# EAGLE design neopixel_board (EAGLE 9.2.2)
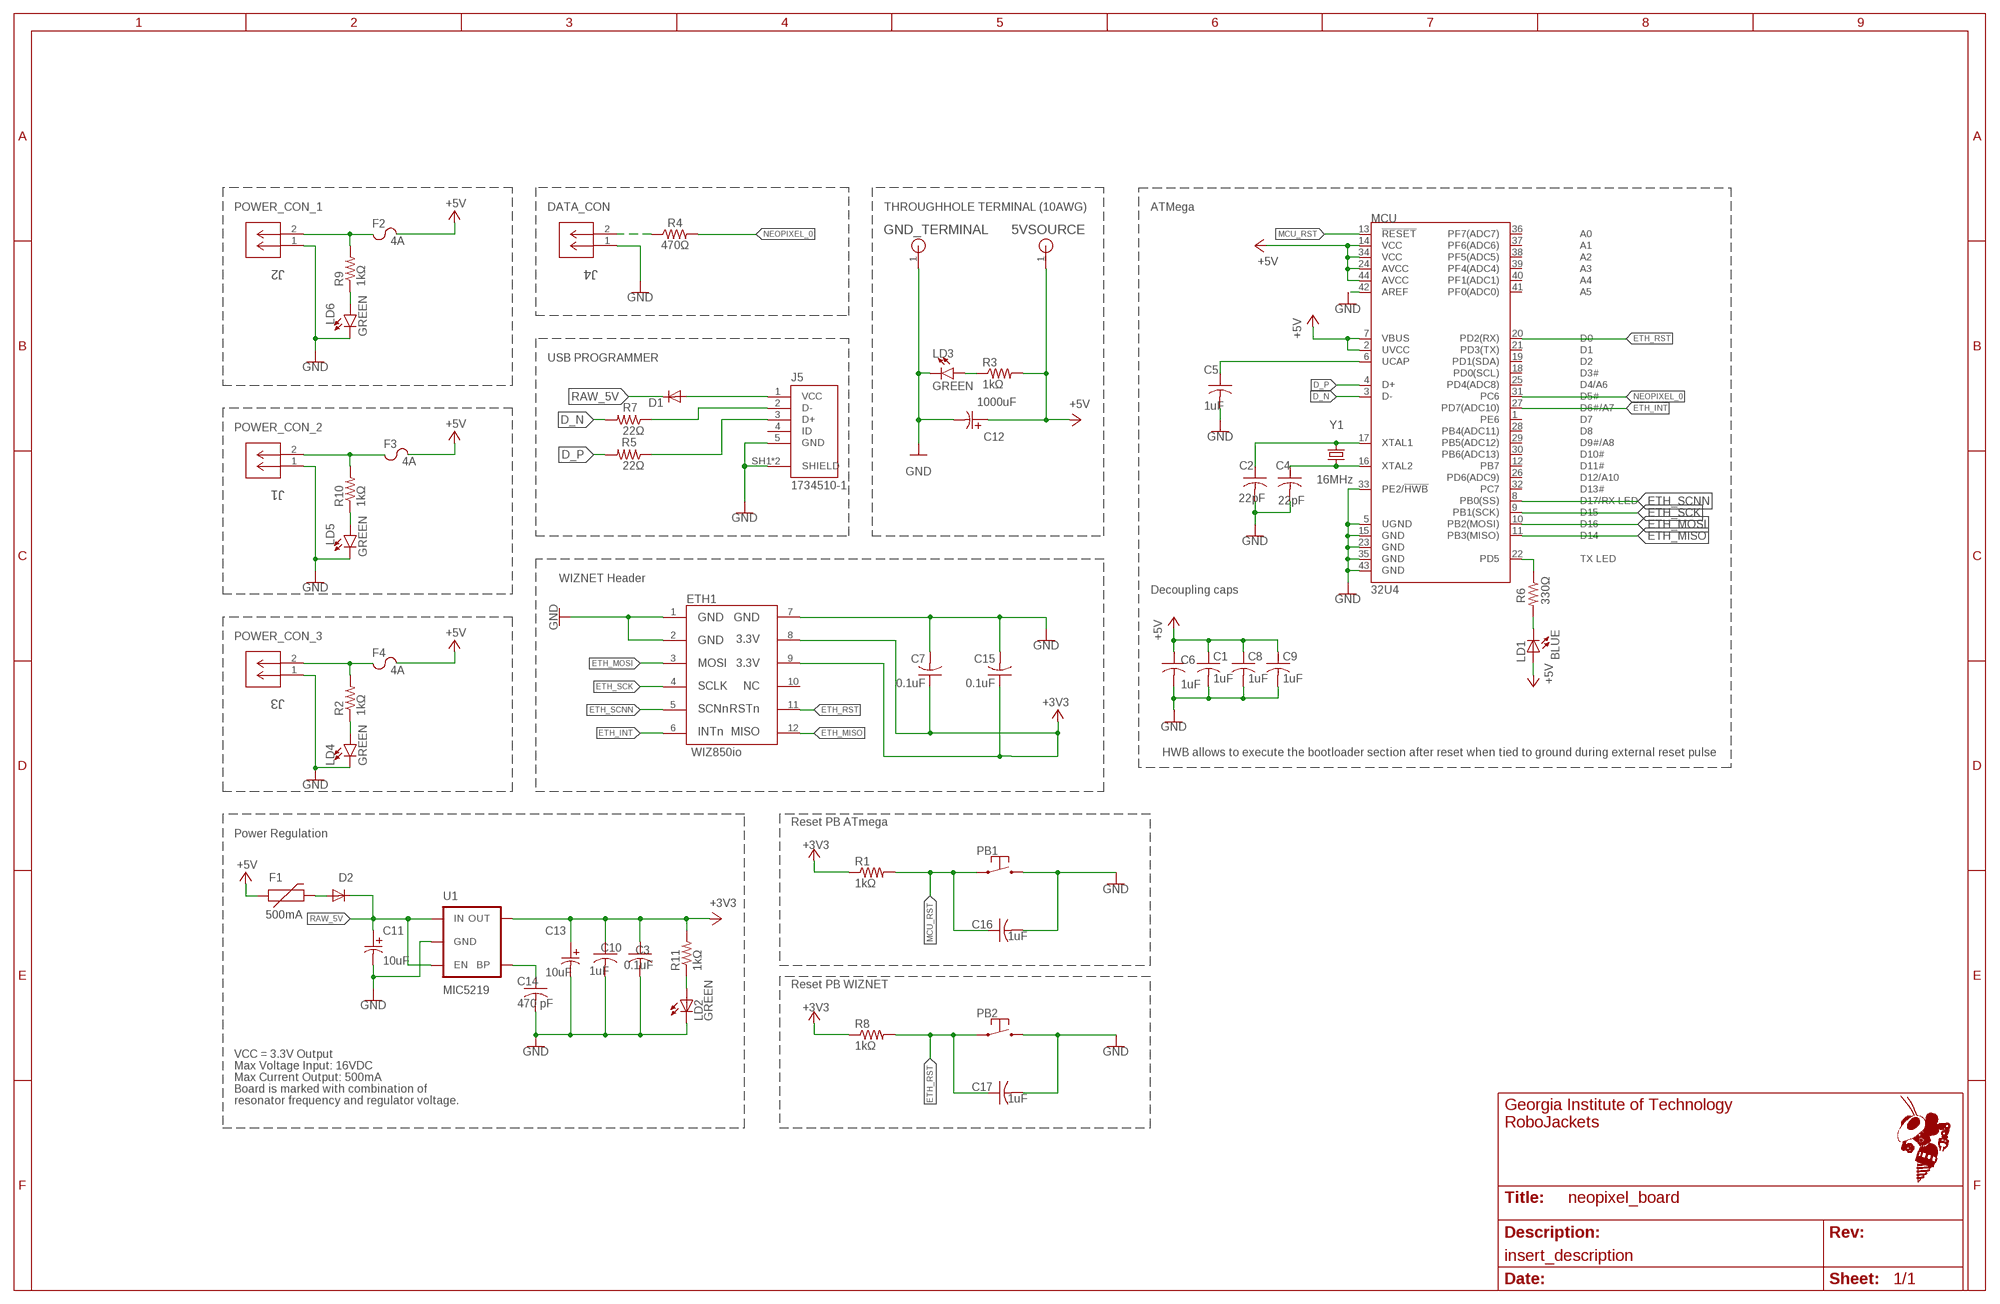
[diagram p0: schematic, sheet 1]
FRAME2 (FRAME_B_L): SCH_DESC: insert_description

## Parts
5VSOURCE  THOLE_SOURCE  [THOLE_SOURCE]
C1  1uF  C-USC0603  [C0603]
C2  22pF  C-USC0603  [C0603]
C3  0.1uF  C-USC0603  [C0603]
C4  22pF  C-USC0603  [C0603]
C5  1uF  C-USC0603  [C0603]
C6  1uF  C-USC0603  [C0603]
C7  0.1uF  C-USC0603  [C0603]
C8  1uF  C-USC0603  [C0603]
C9  1uF  C-USC0603  [C0603]
C10  1uF  C-USC0603  [C0603]
C11  10uF  EEE-1CA100SR  [CAP_4_X_5.4]
C12  1000uF  ECA-0JM102  [PCAP_8X112]
C13  10uF  EEE-1CA100SR  [CAP_4_X_5.4]
C14  470 pF  C-USC0603  [C0603]
C15  0.1uF  C-USC0603  [C0603]
C16  1uF  C-USC0603  [C0603]
C17  1uF  C-USC0603  [C0603]
D1  DIODESOD  [SOD-323]
D2  DIODESOD  [SOD-323]
ETH1  WIZ850IO  [WIZ850IO]
F1  500mA  PTCSMD  [PTC-1206]
F2  4A  3557-2  [3557-2]
F3  4A  3557-2  [3557-2]
F4  4A  3557-2  [3557-2]
GND_TERMINAL  THOLE_SOURCE  [THOLE_SOURCE]
J1  SSW-102-02-T-S-RA  [CON2_1X2_TR_SSQ]
J2  SSW-102-02-T-S-RA  [CON2_1X2_TR_SSQ]
J3  SSW-102-02-T-S-RA  [CON2_1X2_TR_SSQ]
J4  SSW-102-02-T-S-RA  [CON2_1X2_TR_SSQ]
J5  1734510-1  [TE_1734510-1]
LD1  BLUE  LED0603  [LED-0603]
LD2  GREEN  LED0603  [LED-0603]
LD3  GREEN  LED-GREEN0603  [LED-0603]
LD4  GREEN  LED-GREEN0603  [LED-0603]
LD5  GREEN  LED-GREEN0603  [LED-0603]
LD6  GREEN  LED-GREEN0603  [LED-0603]
MCU  32U4  ATMEGA32U4TQFP-44  [TQFP44]
PB1  PTS645PTS645_SMD1  [PTS645_SMD]
PB2  PTS645PTS645_SMD1  [PTS645_SMD]
R1  1kΩ  R-US_R0603  [R0603]
R2  1kΩ  RESISTOR0603-RES  [0603-RES]
R3  1kΩ  RESISTOR0603-RES  [0603-RES]
R4  470Ω  470OHM-0603-1/10W-1%  [0603]
R5  22Ω  RESISTOR0603-RES  [0603-RES]
R6  330Ω  RESISTOR0603-RES  [0603-RES]
R7  22Ω  RESISTOR0603-RES  [0603-RES]
R8  1kΩ  R-US_R0603  [R0603]
R9  1kΩ  RESISTOR0603-RES  [0603-RES]
R10  1kΩ  RESISTOR0603-RES  [0603-RES]
R11  1kΩ  RESISTOR0603-RES  [0603-RES]
U1  MIC5219  V_REG_LDOSMD  [SOT23-5]
Y1  16MHz  CRYSTAL5X3  [CRYSTAL-SMD-5X3]

## Nets
+3V3: C3.1 C7.1 C10.1 C13.1 C15.1 ETH1.8 ETH1.9 R1.1 R8.1 R11.2 U1.5(OUT)
+5V: 5VSOURCE.1 C1.1 C6.1 C8.1 C9.1 C12.1 F1.1 F2.3 F2.4 F3.3 F3.4 F4.3 F4.4 LD1.A MCU.2(UVCC) MCU.7(VBUS) MCU.14(VCC) MCU.24(AVCC) MCU.34(VCC) MCU.44(AVCC) R3.2
D_N [diff_pair]: MCU.3(D-) R7.2
D_P [diff_pair]: MCU.4(D+) R5.2
ETH_INT: ETH1.6 MCU.27(PD7(ADC10))
ETH_MISO: ETH1.12 MCU.11(PB3(MISO))
ETH_MOSI: ETH1.3 MCU.10(PB2(MOSI))
ETH_RST: C17.1 ETH1.11 MCU.20(PD2(RX)) PB2.P$1 PB2.P$2 R8.2
ETH_SCK: ETH1.4 MCU.9(PB1(SCK))
ETH_SCNN: ETH1.5 MCU.8(PB0(SS))
GND [vcc]: C1.2 C2.2 C3.2 C4.2 C5.2 C6.2 C7.2 C8.2 C9.2 C10.2 C11.2 C12.2 C13.2 C14.2 C15.2 C16.2 C17.2 ETH1.1 ETH1.2 ETH1.7 GND_TERMINAL.1 J1.1 J2.1 J3.1 J4.1 J5.5(GND) J5.SH1(SHIELD) J5.SH2(SHIELD) LD2.C LD3.C LD4.C LD5.C LD6.C MCU.5(UGND) MCU.15(GND) MCU.23(GND) MCU.33(PE2/!HWB) MCU.35(GND) MCU.42(AREF) MCU.43(GND) PB1.P$3 PB1.P$4 PB2.P$3 PB2.P$4 U1.2(GND)
MCU_RST: C16.1 MCU.13(!RESET) PB1.P$1 PB1.P$2 R1.2
N$1: C4.1 MCU.16(XTAL2) Y1.1
N$2: C2.1 MCU.17(XTAL1) Y1.3
N$3: J5.2(D-) R7.1
N$4: C5.1 MCU.6(UCAP)
N$5: C14.1 U1.4(BP)
N$6: J5.3(D+) R5.1
N$7: LD1.C R6.2
N$8: D1.2(A) J5.1(VCC)
N$9: D2.2(A) F1.2
N$10: F2.1 F2.2 J2.2 R9.2
N$11: F3.1 F3.2 J1.2 R10.2
N$12: F4.1 F4.2 J3.2 R2.2
N$13: J4.2 R4.1
N$14: LD4.A R2.1
N$15: LD5.A R10.1
N$16: LD6.A R9.1
N$21: LD3.A R3.1
N$38: LD2.A R11.1
NEOPIXEL_0: MCU.31(PC6) R4.2
RAW_5V [vcc]: C11.1 D1.1(C) D2.1(C) U1.1(IN) U1.3(EN)
TXLED: MCU.22(PD5) R6.1
Unconnected: ETH1.10 J5.4(ID) MCU.1(PE6) MCU.12(PB7) MCU.18(PD0(SCL)) MCU.19(PD1(SDA)) MCU.21(PD3(TX)) MCU.25(PD4(ADC8)) MCU.26(PD6(ADC9)) MCU.28(PB4(ADC11)) MCU.29(PB5(ADC12)) MCU.30(PB6(ADC13)) MCU.32(PC7) MCU.36(PF7(ADC7)) MCU.37(PF6(ADC6)) MCU.38(PF5(ADC5)) MCU.39(PF4(ADC4)) MCU.40(PF1(ADC1)) MCU.41(PF0(ADC0))

## Notes on the sheet
- POWER_CON_1 | DATA_CON | THROUGHHOLE TERMINAL (10AWG) | ATMega
- USB PROGRAMMER
- POWER_CON_2
- WIZNET Header
- Decoupling caps
- POWER_CON_3
- HWB allows to execute the bootloader section after reset when tied to ground during external reset pulse
- Reset PB ATmega
- Power Regulation
- Reset PB WIZNET
- VCC = 3.3V Output
- Max Voltage Input: 16VDC
- Max Current Output: 500mA
- Board is marked with combination of
- resonator frequency and regulator voltage.

## Library data of the parts
5VSOURCE GND_TERMINAL = neopixel_board:THOLE_SOURCE
C1-C6 C8-C10 C16 C17 = rcl:C-US: CAPACITOR, American symbol; SPICEPREFIX: C
C7 C14 C15 = rcl:C-US: CAPACITOR, American symbol; SPICEPREFIX: 0.1 uF
C11 C13 = neopixel_board:EEE-1CA100SR
C12 = neopixel_board:ECA-0JM102; MANUFACTURER_PART_NUMBER: ECA0JM102; VENDOR: Panasonic
D1 D2 = SparkFun:DIODE: Diode These are standard reverse protection diodes and small signal diodes. SMA package can handle up to about 1A. SOD-323 can handle about 200mA. What the SOD-323 package when ordering, there are some mfgs out there that are 5-pin packages.
ETH1 = neopixel_board:WIZ850IO
F1 = SparkFun:PTC: Resettable Fuse PTC Resettable Fuse. Spark Fun Electronics SKU : COM-08357
F2-F4 = neopixel_board:3557-2; DIGIKEY: 36-3557-2-ND; MPN: 3557-2
J1-J4 = neopixel_board:SSW-102-02-T-S-RA: 2 postion, right-angle, female header; MANUFACTURER_PART_NUMBER: SSW10202TSRA; VENDOR: Samtec Inc
J5 = 1734510-1:1734510-1: Conn Mini USB Type B RCP 5 POS 1.6mm Solder RA Thru-Hole 5 Terminal 1 Port Tray; MANUFACTURER: TE Connectivity; PARTREV: B1; STANDARD: Manufacturer Recommendation
LD1 LD2 = SparkFun:LED: LEDs Standard schematic elements and footprints for 5mm, 3mm, 1206, and 0603 sized LEDs. 5mm - Spark Fun Electronics SKU : COM-00529 (and others)
LD3-LD6 = SparkFun-LED:LED-GREEN: Green SMD LED Used in manufacturing of various products at SparkFun Packages: 0603 - SMD 0603 package [Product Link] <http://www.futureelectronics.com/en/technologies/semiconductors/optoelectronics/leds/Pages/9894312-LTST-C190GKT.aspx?CrossPart=HSMG-C190&IM=0> LilyPad 1206 - SMD1206 LilyPad package [Product Link] <http://www.futureelectronics.com/en/Technologies/Product.aspx?ProductID=IN150NGHARVATEKCORPORATION2049943&IM=0> 1206 - SMD1206 package [Product Link] <http://www.futureelectronics.com/en/technologies/semiconductors/optoelectronics/leds/Pages/8315665-LTST-C150KGKT.aspx?IM=0> 1206 Bottom Mount -SMD 1206 Bottom Mount [Product Link] <http://www.digikey.com/product-detail/en/lite-on-inc/LTST-C230KGKT/160-1456-1-ND/386854> SparkFun Products: Pro Mini 328 -5V <https://www.sparkfun.com/products/821> RedBoard <https://www.sparkfun.com/products/12757> MP3 Trigger <https://www.sparkfun.com/products/13720> Makey Makey <https://www.sparkfun.com/products/11076>; PROD_ID: DIO-00821
MCU = SparkFun-IC-Microcontroller:ATMEGA32U4: Atmel MCU, 32KByte Atmel 44-pin 8-bit Microcontroller with 32KBytes of ISP Flash and USB Controller Datasheet <http://cdn.sparkfun.com/datasheets/Dev/Arduino/Boards/ATMega32U4.pdf> SparkFun Products LilyPad Arduino USB - ATmega32U4 Board <https://www.sparkfun.com/products/12049> (DEV-12049) Pro Micro - 5V/16MHz <https://www.sparkfun.com/products/12640> (DEV-12640) Pro Micro - 3.3V/8MHz <https://www.sparkfun.com/products/12587> (DEV-12587) Fio v3 - ATmega32U4 <https://www.sparkfun.com/products/11520> (DEV-11520) Qduino Mini <https://www.sparkfun.com/products/13614> (DEV-13614) Makey Makey - Standard Kit <https://www.sparkfun.com/products/11511> (WIG-11511) Makey Makey Deluxe Kit <https://www.sparkfun.com/products/11519> (WIG-11519); PROD_ID: IC-11161
PB1 PB2 = Training_Board:PTS645: Tactile Momentary Pushbutton with thru-hole legs. https://www.ckswitches.com/media/1471/pts645.pdf
R1 R8 = rcl:R-US_: RESISTOR, American symbol; SPICEPREFIX: R
R2 R3 R5-R7 R9-R11 = SparkFun:RESISTOR: Resistor Basic schematic elements and footprints for 0603, 1206, and PTH resistors.
R4 = SparkFun-Resistors:470OHM: 470Ω resistor A resistor is a passive two-terminal electrical component that implements electrical resistance as a circuit element. Resistors act to reduce current flow, and, at the same time, act to lower voltage levels within circuits. - Wikipedia; PROD_ID: RES-07869; VALUE: 470
U1 = SparkFun:V_REG_LDO: Voltage Regulator LDO Standard 150mA LDO voltage regulator in SOT-23 layout. Micrel part MIC5205. BP (by-pass) pin is used to lower output noise with 470pF cap.
Y1 = SparkFun:CRYSTAL: Crystals Various standard crystals. Proven footprints. Spark Fun Electronics SKU : COM-00534

## Net classes
2 diff_pair: width 0.305 mm

## Board
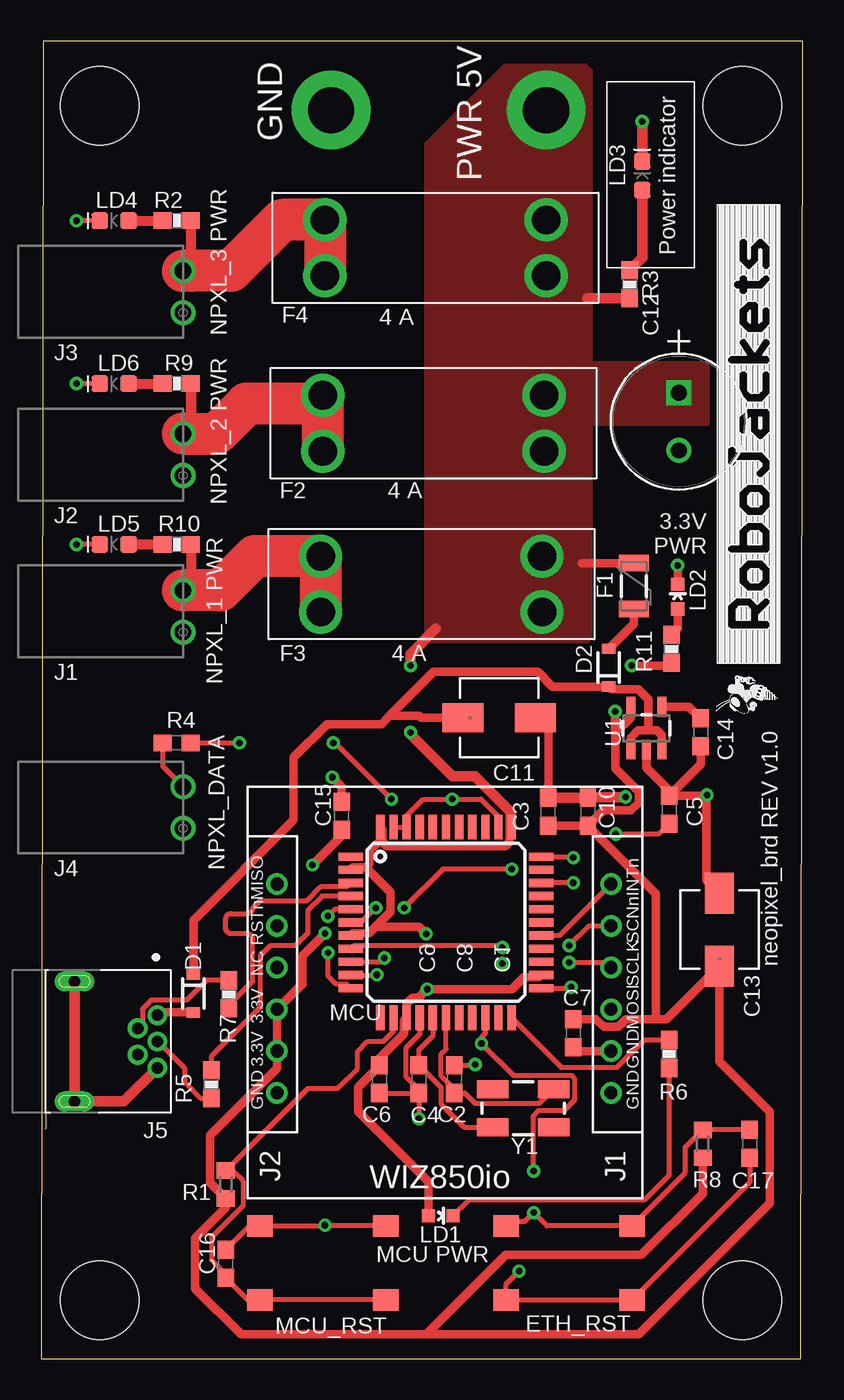
[diagram p1: board, top side]
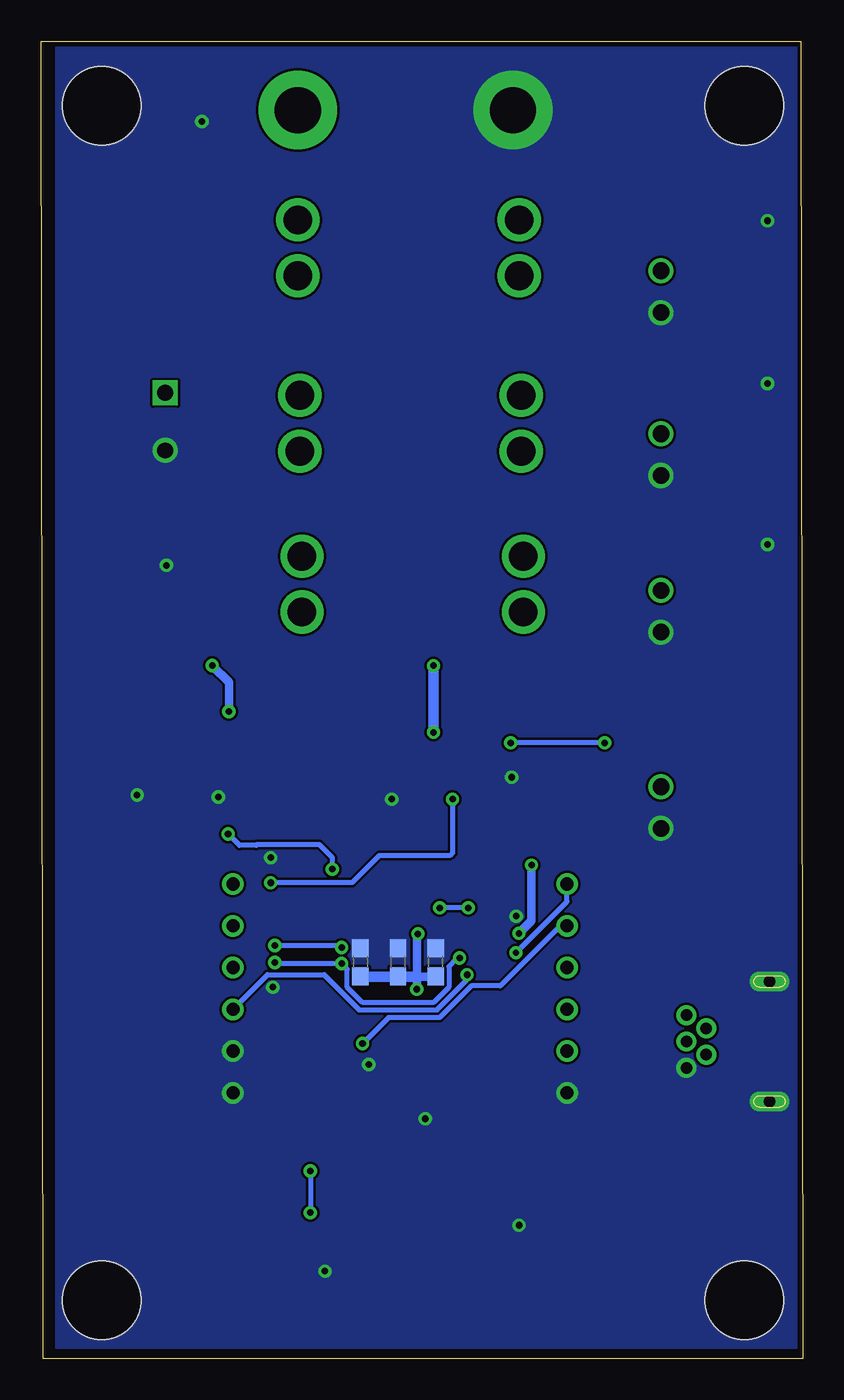
[diagram p2: board, bottom side, seen from below]

Size 46.35 x 80.14 mm. Coordinates in mm from the lower left corner, seen from the top.
Outline: 0,0 46.23,0 46.35,80.14 0.13,80.14 0,0
Copper layers (1*16): Top 0.0356mm / dielectric 63mil / Bottom 0.0356mm
Design rules "RJ2LayerDRU": minimum track width 6mil, minimum drill 15mil, track to track 6mil, track to pad 6mil, pad to pad 6mil, via to via 6mil, smd to smd 6mil, copper to edge 0mil, drill to drill 6mil, minimum pad ring 10mil, minimum via ring 8mil, stop-mask expansion 4mil, vias tented up to drill 0mil, thermal gap 10mil
Holes 4.76 mm at 3.56,76.2 42.67,76.2 3.56,3.56 42.67,3.56

### Footprints (pad centres in the part's own frame; a part is rotated, then mirrored left to right if it is on the bottom)
THOLE_SOURCE = drill 2.8 pad 4.8: 1 0,0
C0603 = smd 1.1 x 1: 1 -0.85,0; 2 0.85,0
CAP_4_X_5.4 = smd 2.489 x 1.753: 1 -2.21,0; 2 2.21,0
PCAP_8X112 = drill 0.965 pad 1.524 square: 1 -3.505,0 | drill 0.965 pad 1.524: 2 0,0
SOD-323 = smd 0.63 x 0.83: 1 -1.15,0; 2 1.15,0
WIZ850IO = drill 0.8: 1 6.4,1.9; 2 8.94,1.9; 3 11.48,1.9; 4 14.02,1.9; 5 16.56,1.9; 6 19.1,1.9; 7 6.4,22.22; 8 8.94,22.22; 9 11.48,22.22; 10 14.02,22.22; 11 16.56,22.22; 12 19.1,22.22
PTC-1206 = smd 1 x 1.8: 1 -1.4,0; 2 1.4,0
3557-2 = drill 1.75: 1 -6.735,1.7; 2 -6.735,-1.7; 3 6.735,-1.7; 4 6.735,1.7
CON2_1X2_TR_SSQ = drill 1.016 pad 1.524: 1 -1.27,0; 2 1.27,0
TE_1734510-1 = drill 0.7 pad 1.2: 1 -1.6,5.05; 2 -0.8,3.85; 3 0,5.05; 4 0.8,3.85; 5 1.6,5.05 | drill 0.7 long: SH1 3.65,0; SH2 -3.65,0
LED-0603 = smd 0.8 x 0.8: A 0,-0.75; C 0,0.75
LED-0603' = smd 1 x 1: A -0.877,0; C 0.877,0
TQFP44 = smd 1.5 x 0.5: 1 -5.8,4; 2 -5.8,3.2; 3 -5.8,2.4; 4 -5.8,1.6; 5 -5.8,0.8; 6 -5.8,0; 7 -5.8,-0.8; 8 -5.8,-1.6; 9 -5.8,-2.4; 10 -5.8,-3.2; 11 -5.8,-4; 23 5.8,-4; 24 5.8,-3.2; 25 5.8,-2.4; 26 5.8,-1.6; 27 5.8,-0.8; 28 5.8,0; 29 5.8,0.8; 30 5.8,1.6; 31 5.8,2.4; 32 5.8,3.2; 33 5.8,4 | smd 0.5 x 1.5: 12 -4,-5.8; 13 -3.2,-5.8; 14 -2.4,-5.8; 15 -1.6,-5.8; 16 -0.8,-5.8; 17 0,-5.8; 18 0.8,-5.8; 19 1.6,-5.8; 20 2.4,-5.8; 21 3.2,-5.8; 22 4,-5.8; 34 4,5.8; 35 3.2,5.8; 36 2.4,5.8; 37 1.6,5.8; 38 0.8,5.8; 39 0,5.8; 40 -0.8,5.8; 41 -1.6,5.8; 42 -2.4,5.8; 43 -3.2,5.8; 44 -4,5.8
PTS645_SMD = smd 1.55 x 1.3: P$1 -3.835,2.25; P$2 3.835,2.25; P$3 3.835,-2.25; P$4 -3.835,-2.25
R0603 = smd 1 x 1.1: 1 -0.85,0; 2 0.85,0
0603-RES = smd 1.1 x 1: 1 -0.85,0; 2 0.85,0
0603 = smd 1.1 x 1: 1 -0.85,0; 2 0.85,0
SOT23-5 = smd 0.55 x 1.2: 1 -0.95,-1.3; 2 0,-1.3; 3 0.95,-1.3; 4 0.95,1.3; 5 -0.95,1.3
CRYSTAL-SMD-5X3 = smd 1.9 x 1.1: 1 -1.85,-1.15; 2 1.85,-1.15; 3 1.85,1.15; 4 -1.85,1.15

### Placement (x,y rotation side)
5VSOURCE  30.73,75.95 0 top
C1  26.92,24.13 90 bottom
C2  25.15,17.02 90 top
C3  30.86,33.27 90 top
C4  22.99,17.02 270 top
C5  38.23,33.4 90 top
C6  20.57,17.02 270 top
C7  32.38,19.81 270 top
C8  24.64,24.13 90 bottom
C9  22.35,24.13 90 bottom
C10  33.27,33.27 90 top
C11  27.88,38.99 0 top
C12  38.8,55.25 270 top
C13  41.27,26.1 90 top
C14  40.13,38.1 270 top
C15  18.29,33.02 90 top
C16  11.24,5.78 90 top
C17  43.12,13.08 270 top
D1  9.27,22.23 270 top
D2  34.54,42.04 90 top
ETH1  36.58,9.78 90 top
F1  36.07,46.99 270 top
F2  23.88,56.9 0 top
F3  23.75,47.12 0 top
F4  24,67.56 0 top
GND_TERMINAL  17.65,75.95 0 top
J1  8.64,45.47 90 top
J2  8.64,54.99 90 top
J3  8.64,64.9 90 top
J4  8.64,33.53 90 top
J5  2.03,19.3 270 top
LD1  24.32,8.7 270 top
LD2  38.73,46.36 0 top
LD3  GREEN  [LED-0603']  36.58,71.95 90 top
LD4  GREEN  [LED-0603']  4.45,69.22 180 top
LD5  GREEN  [LED-0603']  4.45,49.53 180 top
LD6  GREEN  [LED-0603']  4.45,59.31 180 top
MCU  24.64,26.54 0 top
PB1  17.14,5.84 180 top
PB2  32.13,5.84 0 top
R1  11.24,10.6 90 top
R2  8.26,69.22 0 top
R3  35.81,65.34 270 top
R4  8.26,37.47 0 top
R5  10.35,16.7 90 top
R6  38.23,18.54 270 top
R7  11.43,22.16 270 top
R8  40.26,13.08 90 top
R9  8.26,59.31 0 top
R10  8.26,49.53 0 top
R11  38.35,43.18 270 top
U1  36.83,38.35 0 top
U$1  [ROBOJACKETS]  44.96,42.29 90 top
U$2  [ROBOBUZZ_0.2X]  44.83,40.13 90 top
Y1  29.34,15.24 0 top

### Tracks (layer width: path | path; a pad name or v marks a point on that pad's centre or on a via)
+3V3  (via drill 0.38, 0.4)
  Top 0.508: C3.1 C10.1 | v35.94,42.16 38.19,42.16 R11.2 | 34.95,38.07 35.88,39 U1.5 | v34.92,39.37 34.92,38.1 34.95,38.07 | 18.46,32.34 C15.1 18.29,31.81 v16.51,30.04 | C7.1 33.77,20.66 34.24,20.2 35.11,20.2 35.58,20.66 37.4,20.66 | 37.4,20.66 38.05,20.66 C13.1 41.27,18.1 44.34,15.03 44.34,9.46 36.37,1.49 23.45,1.49 | 37.4,20.66 37.4,28.3 C10.1 | C10.1 34.2,33.35 35.89,33.35 36.37,33.83 36.37,34.5 34.95,35.91 34.95,38.07 | v17.28,25.87 15.92,24.51 15.92,22.78 15.88,22.78 ETH1.9 ETH1.8 14.36,17.68 10.28,13.61 10.28,10.71 R1.1 11.24,9.21 9.38,7.35 9.38,4.27 12.16,1.49 23.45,1.49 | 23.45,1.49 28.28,6.32 36.53,6.32 40.26,10.05 R8.1
  Bottom 0.508: v35.94,42.16 34.92,41.15 v34.92,39.37 | v17.28,25.87 16.51,26.64 v16.51,30.04
+5V  (via drill 0.38, 0.4)
  Top 0.508: F1.1 32.9,48.39 | 20.78,31.43 21.02,31.19 28.26,31.19 28.49,31.43 28.49,32.2 MCU.34 | 20.78,31.43 20.78,32.2 MCU.44 | 20.78,31.43 20.52,31.43 19.99,30.9 19.99,30.12 19.76,29.89 | MCU.2 18.98,29.89 19.76,29.89 | 19.76,29.89 21.27,28.37 21.27,27.2 20.34,26.27 | MCU.7 18.98,25.89 19.96,25.89 20.34,26.27 | 20.34,26.27 23.01,26.27 v23.43,25.84 | MCU.24 30.29,23.2 29.39,23.2 28.66,22.48 v23.5,22.48 22.98,21.96 22.59,21.96 22.24,21.61 MCU.14 22.09,20.6 22.09,19.78 20.57,18.26 C6.1 20.57,17.79 19.29,16.5 19.29,15.07 23.57,10.79 LD1.A
  Top 0.635: R3.2 33.23,64.49 | MCU.34 28.56,32.42 28.56,33.29 26.41,35.43 25.02,35.43 22.48,37.97 v22.48,38.1 | v22.48,42.16 22.48,42.86 24,44.39
  Bottom 0.152: C8.1 24.6,23.24
  Bottom 0.305: C9.1 22.35,23.24
  Bottom 0.508: 22.35,23.24 23.5,23.24 | 23.5,23.24 v23.5,22.48 | 24.6,23.24 23.5,23.24 | v23.43,25.84 23.5,25.78 23.5,23.24
  Bottom 0.635: 23.5,23.24 26.89,23.24 C1.1 | v22.48,38.1 v22.48,42.16
  pour Top (no thermals): 28.19,78.74 33.15,78.74 33.53,78.36 33.53,43.81 33.27,43.56 23.37,43.56 23.37,73.91
  pour Top (no thermals): 32.89,60.64 40.64,60.64 40.64,56.77 32.89,56.77
D_N
  Top 0.305: R7.2 11.43,21.53 12.05,22.16 12.06,22.16 12.88,22.98 12.88,25.51 arc90 12.54,25.86 11.57,25.86 arc-90 11.22,26.2 11.22,26.74 arc-90 11.57,27.08 12.54,27.08 arc90 12.88,27.42 13.32,27.87 16.17,27.87 17,28.7 18.59,28.7 MCU.3
D_P
  Top 0.305: MCU.4 17.09,28.14 16.26,27.3 16.26,25.91 15.49,25.15 13.97,25.15 13.34,24.51 13.34,21.38 10.35,18.39 R5.2
ETH_INT
  Top 0.305: MCU.27 30.86,25.74 31.07,25.74 31.54,25.74 ETH1.6
ETH_MISO  (via drill 0.38)
  Top 0.305: MCU.11 18.59,22.79 17.96,22.79 17.46,23.29 v17.46,24.7
  Bottom 0.305: v17.46,24.7 14.36,27.81 ETH1.12
ETH_MOSI  (via drill 0.4)
  Top 0.305: MCU.10 20.42,23.34 v20.44,23.36
  Bottom 0.305: ETH1.3 32.57,23.36 29.13,23.36 26.98,21.21 22.29,21.21 20.44,23.07 v20.44,23.36
ETH_RST  (via drill 0.4)
  Top 0.305: PB2.P$1 28.55,8.34 29.43,8.34 v29.97,8.89 30.77,8.09 PB2.P$2 39.2,11.32 39.2,12.87 R8.2 C17.1 | MCU.20 27.05,20.73 27.05,19.81 26.8,19.56 v26.8,19.18 28.73,17.24 32.26,17.24 32.44,17.07 32.44,15.71 31.81,15.08 30.24,15.08 29.93,14.77 29.93,11.47 v29.97,11.43
  Bottom 0.305: v29.97,11.43 v29.97,8.89 | v26.8,19.18 25.22,20.75 22.1,20.75 20.18,22.68 18.41,22.68 14.75,26.34 ETH1.11
ETH_SCK  (via drill 0.4)
  Top 0.305: MCU.9 20.65,24.14 v20.89,24.38 | v32.13,24.11 34.36,24.11 ETH1.4
  Bottom 0.305: v32.13,24.11 32.07,24.05 v28.07,24.05 28.07,24.02 27.73,23.68 27.73,22.6 26.79,21.67 22.48,21.67 21.55,22.6 21.55,23.85 21.02,24.38 v20.89,24.38
ETH_SCNN  (via drill 0.4)
  Top 0.305: v28.07,25.02 27.96,25.12 19.02,25.12 MCU.8 | v32.13,25.15 33.32,26.34 ETH1.5
  Bottom 0.305: v32.13,25.15 28.19,25.15 v28.07,25.02
GND  (via drill 0.4)
  Top 0.305: LD5.C v2.16,49.53 | LD6.C v2.16,59.31 | LD4.C v2.16,69.22 | MCU.23 32.2,22.54 v32.26,22.61 | MCU.5 17.87,27.34 v17.45,26.92 | MCU.43 MCU.42 22.24,33.02 23.24,34.02 25.01,34.02 v25.02,34.04 26.78,34.04 27.84,32.97 MCU.35 | MCU.33 32.32,30.54 v32.38,30.48 | C7.2 32.63,18.72 | C6.2 22.86,16.17 | 22.86,16.17 C4.2 v22.99,14.61 | MCU.15 23.04,19.74 22.18,18.89 22.18,17.19 22.86,16.51 22.86,16.17 | C2.2 26.38,17.87 v26.42,17.91 | v29.08,5.33 28.3,4.55 PB2.P$4 PB2.P$3 43.12,10.74 C17.2 | PB1.P$4 20.94,8.13 v17.27,8.13 17.24,8.09 PB1.P$3 12.7,8.09 C16.2
  Top 0.508: U1.2 36.83,35.94 38.23,34.54 C5.2 | C5.2 40.13,36.16 C14.2 | 32.63,18.72 ETH1.2 | C5.2 40.47,34.25 40.47,29.11 C13.2 | LD2.C v38.73,48.26 | C15.2 18.29,34.8 v17.72,35.37 | C11.2 30.86,38.21 C3.2
  Top 0.635: v36.58,75.25 LD3.C | C3.2 C10.2 33.31,34.16 v35.56,34.16 | 40.47,34.25 v40.51,34.29 | J5.SH2 J5.SH1 5.03,15.65 J5.5
  pour Bottom (no thermals): 0.38,79.76 45.47,79.76 45.47,0.63 0.38,0.63
MCU_RST
  Top 0.305: PB1.P$1 PB1.P$2 12.58,3.59 C16.1 11.24,5.15 10.37,6.02 10.37,7.4 12.29,9.32 12.29,10.82 11.66,11.45 R1.2 16.23,16.45 18.03,16.45 19.24,17.65 19.24,18.67 19.88,19.3 20.83,19.3 21.44,19.91 MCU.13 21.44,21.37
N$1
  Top 0.305: MCU.16 23.88,20.7 23.88,19.68 22.99,18.8 C4.1 24.34,16.51 24.34,15.49 25.74,14.09 Y1.1
N$2
  Top 0.305: Y1.3 30.33,15.54 26.41,15.54 25.78,16.17 C2.1 25.15,16.39 24.34,17.19 24.34,18.54 24.64,18.84 MCU.17
N$3
  Top 0.305: R7.1 10.07,23.01 8.87,21.81 6.71,21.81 6.17,21.28 6.17,20.39 J5.2
N$4  (via drill 0.4)
  Top 0.305: v20.36,27.43 19.47,26.54 MCU.6 | v34.97,31.93 37.6,31.93 C5.1 | v22.1,27.43 24.45,29.78 v28.64,29.78
  Bottom 0.305: v20.36,27.43 v22.1,27.43 | v34.97,31.93 34.28,31.23 33.26,31.23 33.22,31.28 29.43,31.28 28.64,30.49 v28.64,29.78
N$5
  Top 0.508: C14.1 39.43,39.65 U1.4
N$6
  Top 0.305: J5.3 8.72,17.67 8.72,16.81 9.68,15.85 R5.1
N$7
  Top 0.305: R6.2 38.23,11.18 36.7,9.65 26.02,9.65 LD1.C
N$8
  Top 0.508: J5.1 7.25,21.07 D1.2
N$9
  Top 0.508: D2.2 36.07,44.71 F1.2
N$10
  Top 0.635: R9.2 9.14,59.27 9.14,56.27 9.13,56.26
  Top 2.54: F2.2 F2.1 16.63,58.09 12.5,58.09 10.67,56.26 9.13,56.26 J2.2
N$11
  Top 0.61: R10.2 9.14,49.49 9.14,47.93
  Top 0.635: 9.14,47.93 8.64,47.42 J1.2
  Top 2.54: J1.2 10.92,46.74 13,48.82 F3.1 F3.2
N$12
  Top 0.203: 9.14,67.06 9.13,67.04 9.13,66.17
  Top 0.61: R2.2 9.11,67.09 9.14,67.06
  Top 2.54: J3.2 9.13,66.17 11.56,66.17 14.65,69.26 F4.1 F4.2
N$13
  Top 0.305: R4.1 7.41,36.03 J4.2
N$14
  Top 0.61: LD4.A R2.1
N$15
  Top 0.61: LD5.A R10.1
N$16
  Top 0.61: LD6.A R9.1
N$21
  Top 0.635: LD3.A 36.58,66.95 R3.1
N$38
  Top 0.508: R11.1 38.73,44.41 LD2.A
NEOPIXEL_0  (via drill 0.4)
  Top 0.305: R4.2 v12.07,37.47 | v32.38,28.96 MCU.31 | v21.32,34.04 17.89,37.47 v17.78,37.47
  Bottom 0.305: v21.32,34.04 21.32,30.78 21.49,30.61 25.78,30.61 27.43,28.96 v32.38,28.96 | v12.07,37.47 v17.78,37.47
RAW_5V
  Top 0.508: 21.21,39.12 23.88,41.78 30.23,41.78 31.12,40.89 D2.1 34.71,40.72 36.35,40.72 36.96,40.12 36.96,38.23 | 21.21,39.12 20.7,38.61 17.4,38.61 15.37,36.58 15.37,32.77 9.27,26.68 D1.1 | 21.21,39.12 22.98,39.12 23.11,38.99 C11.1 | U1.3 37.78,37.91 37.46,38.23 36.96,38.23 | U1.1 35.88,37.78 36.32,38.23 36.96,38.23
TXLED
  Top 0.305: R6.1 36.7,19.39 35.04,17.73 31.65,17.73 MCU.22

### Text on the board
tPlace: GND | PWR 5V | Power indicator | NPXL_3 PWR | 4 A | 4 A | NPXL_2 PWR | 4 A | NPXL_1 PWR | neopixel_brd REV v1.0 | MCU_RST | ETH_RST
tNames: 3.3V / PWR | NPXL_DATA | MCU PWR